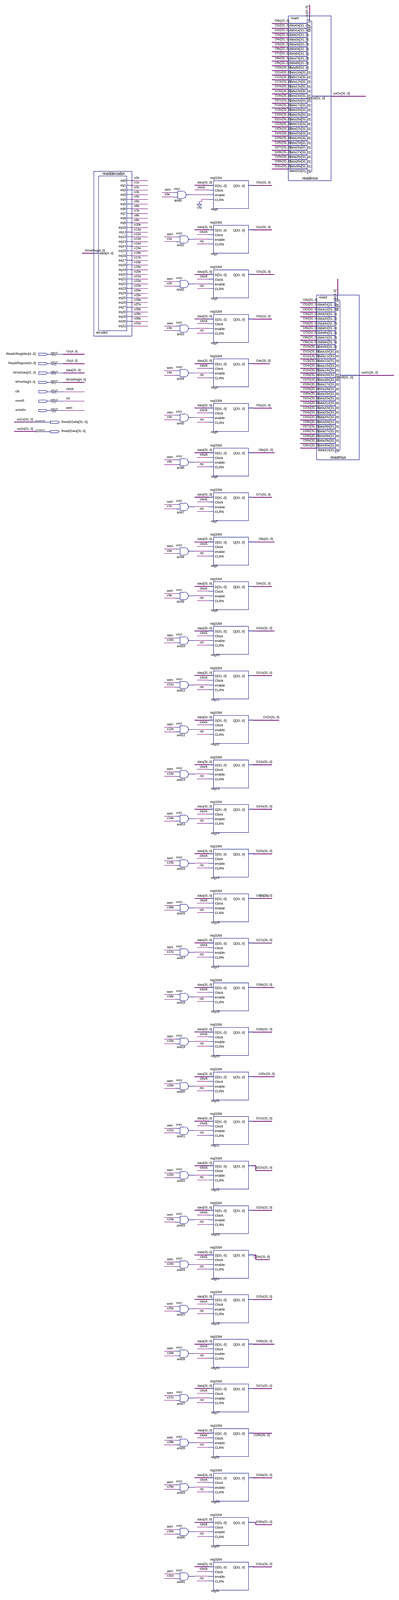
[diagram p0: schematic sheet, whole]
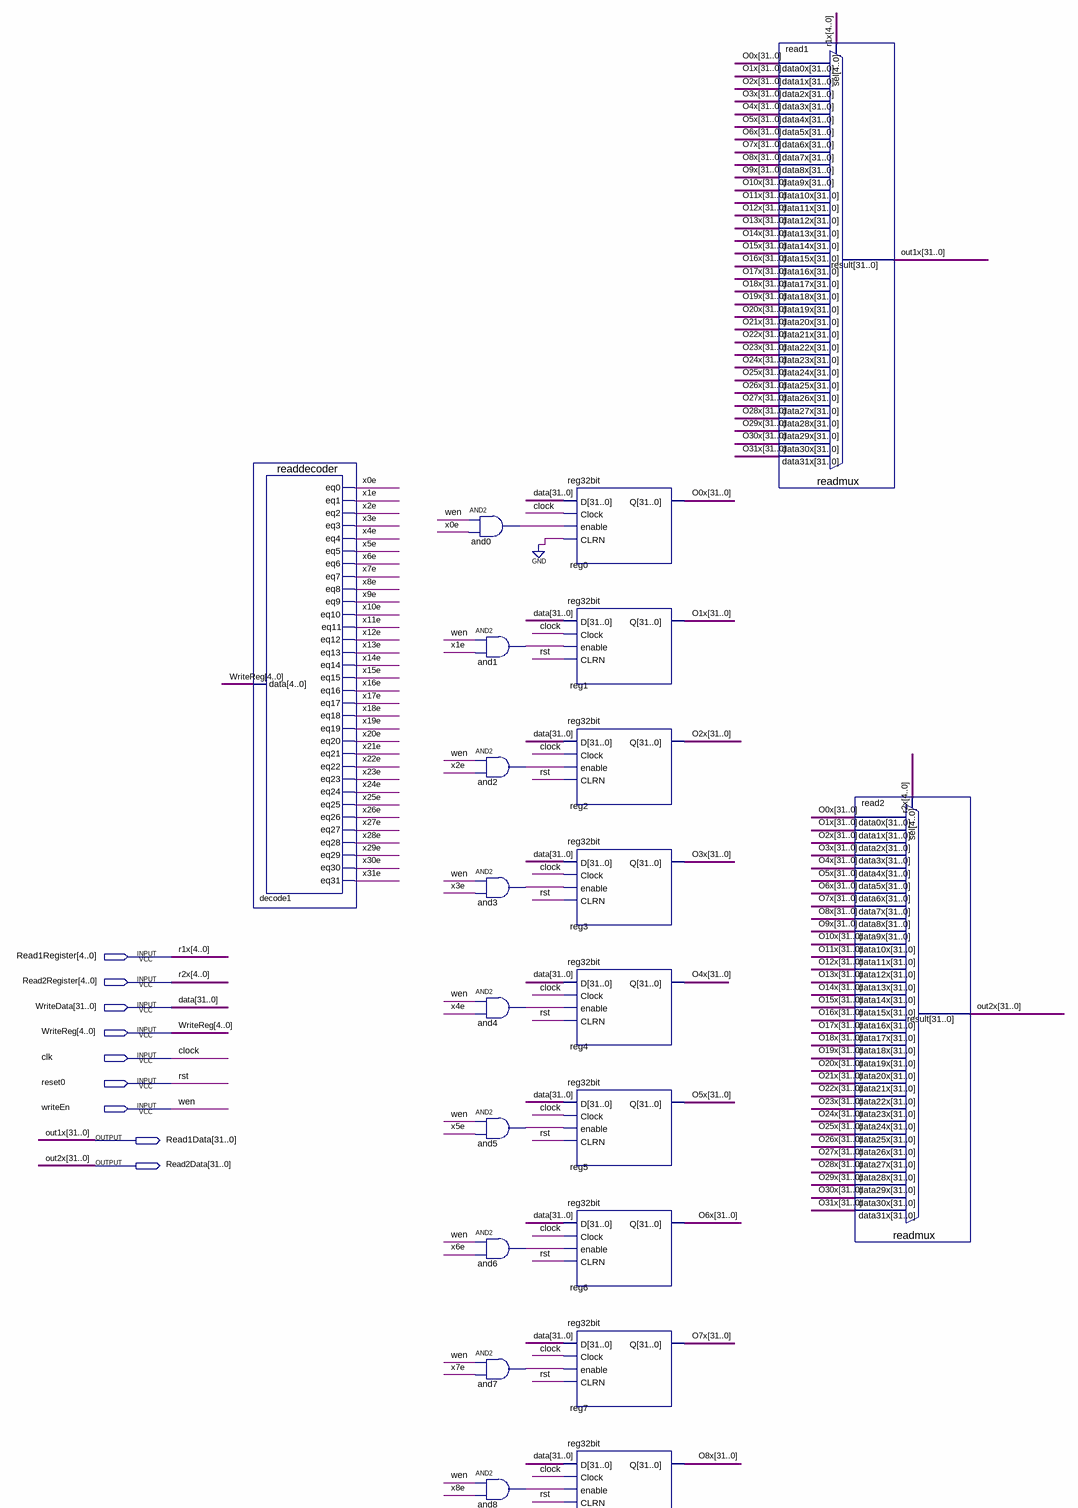
[diagram p1: schematic sheet, upper part]
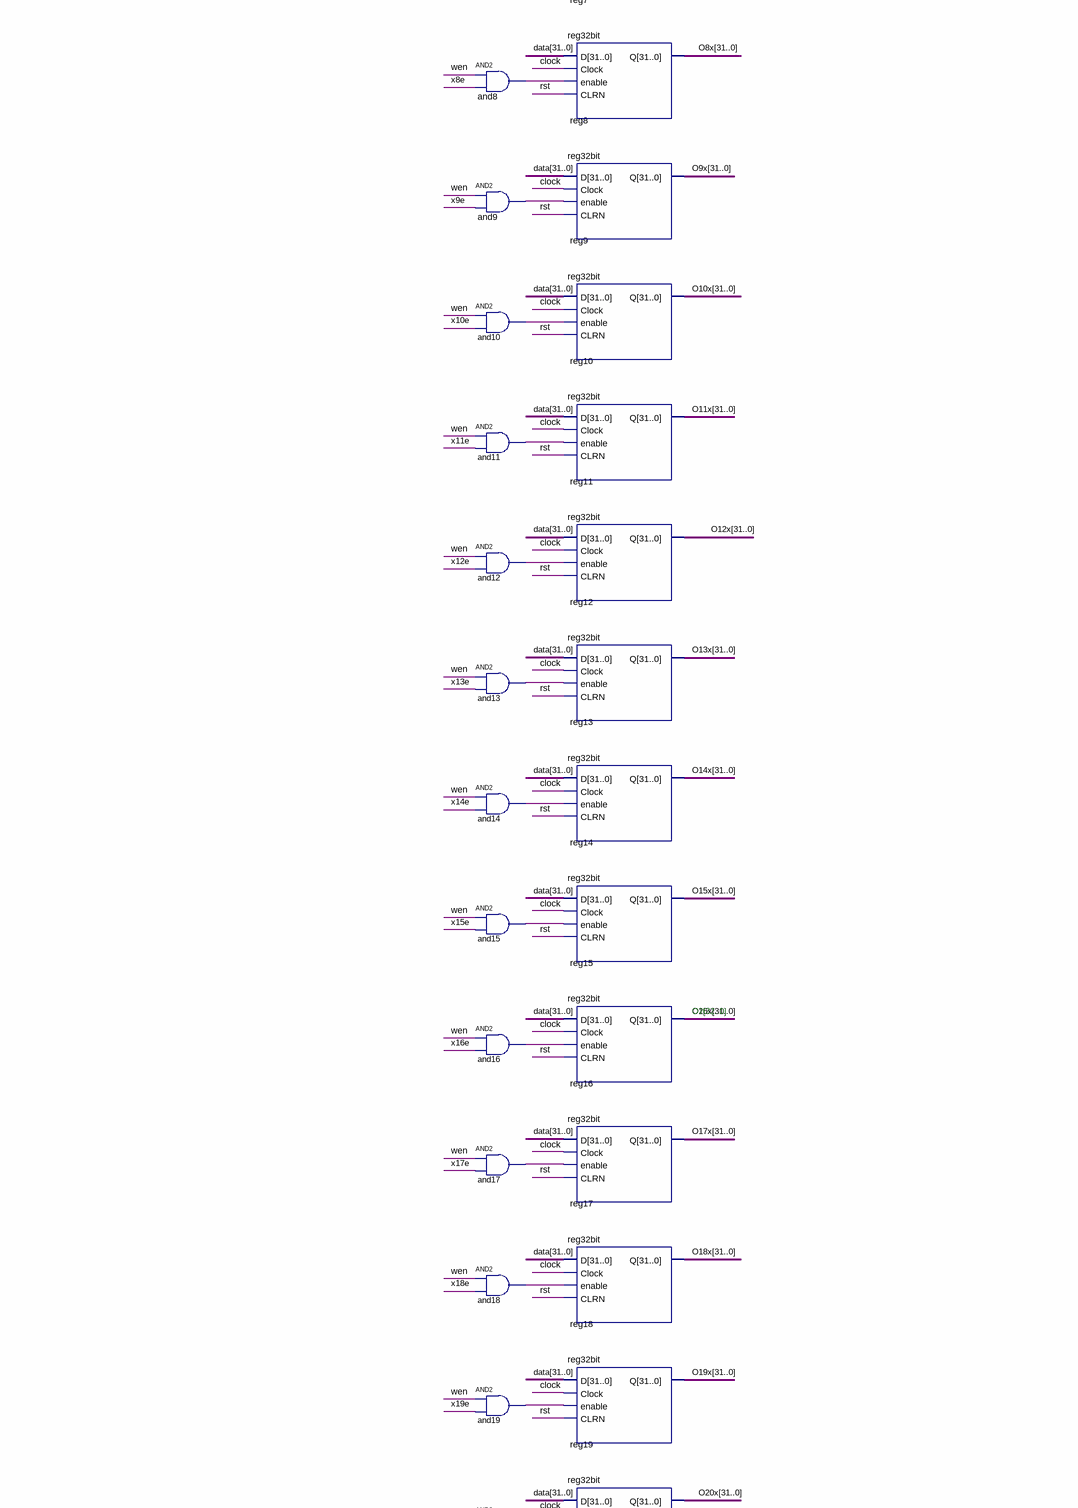
[diagram p2: schematic sheet, middle part]
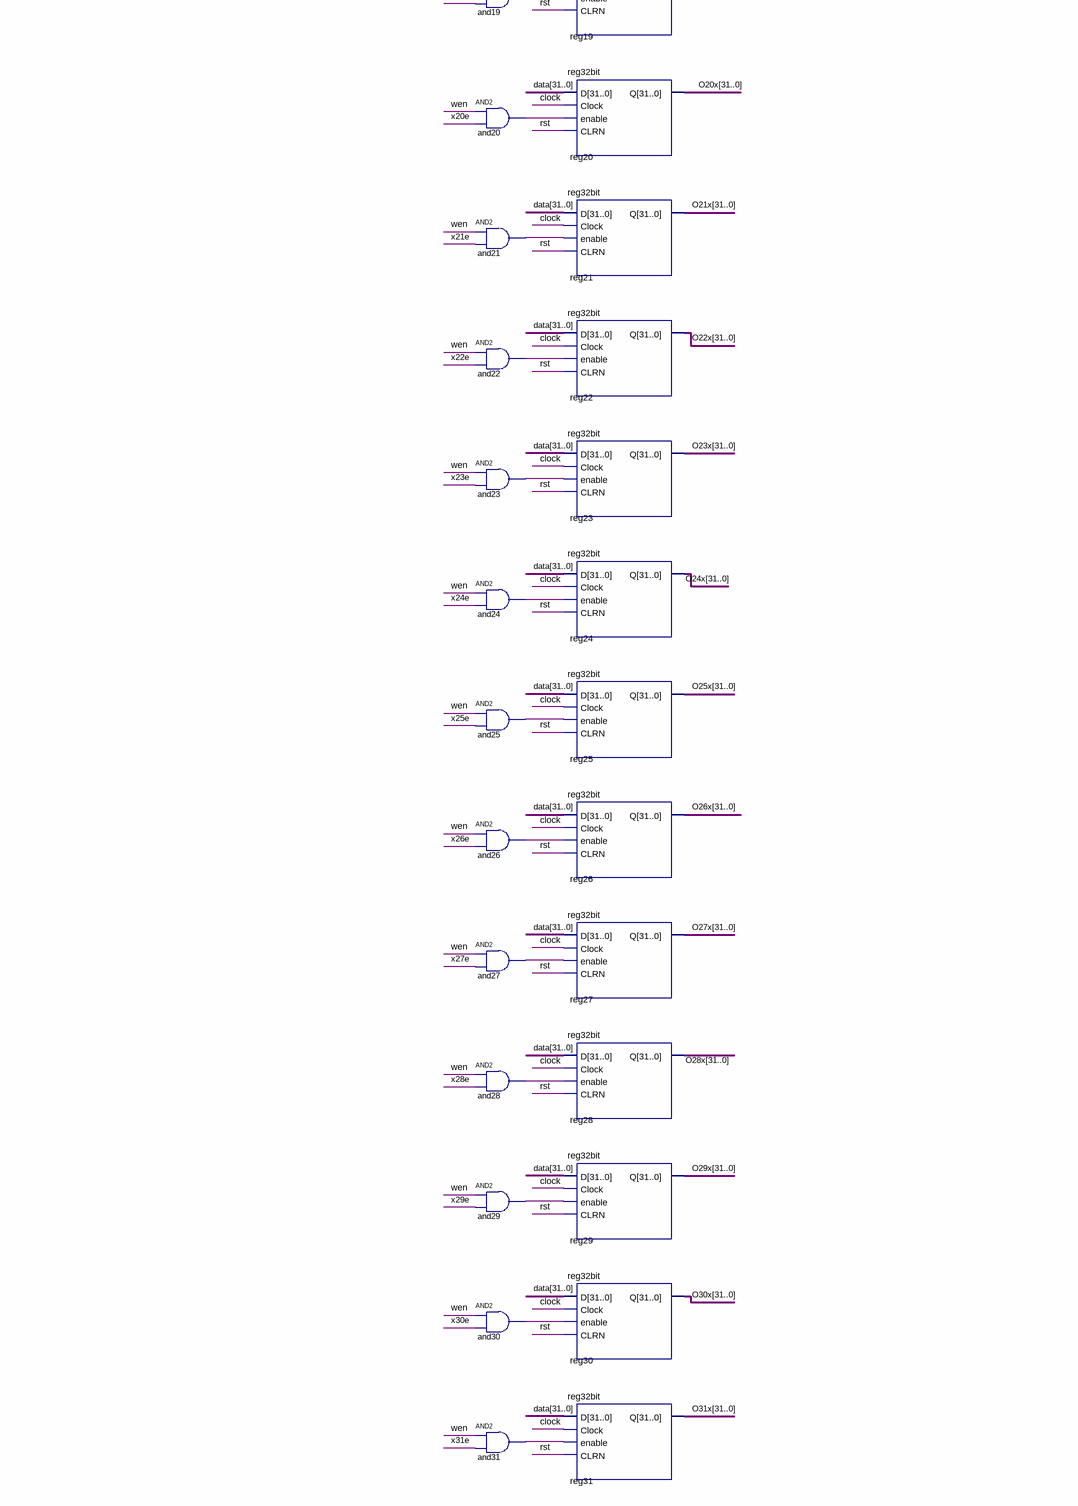
[diagram p3: schematic sheet, lower part]
// Quartus schematic regfile32.bdf as structural Verilog: 67 symbols, 9 pins
module regfile32 (
  input  [4:0] Read1Register,
  input  [4:0] Read2Register,
  input  [31:0] WriteData,
  input  [4:0] WriteReg,
  input  clk,
  input  reset0,
  input  writeEn,
  output [31:0] Read1Data,
  output [31:0] Read2Data
);

  wire and0_out, and1_out, and2_out, and3_out, and4_out, and5_out, and6_out, and7_out, and8_out, and9_out,
       and10_out, and11_out, and12_out, and13_out, and14_out, and15_out, and16_out, and17_out, and18_out,
       and19_out, and20_out, and21_out, and22_out, and23_out, and24_out, and25_out, and26_out, and27_out,
       and28_out, and29_out, and30_out, and31_out, x0e, x1e, x2e, x3e, x4e, x5e, x6e, x7e, x8e, x9e, x10e,
       x11e, x12e, x13e, x14e, x15e, x16e, x17e, x18e, x19e, x20e, x21e, x22e, x23e, x24e, x25e, x26e, x27e,
       x28e, x29e, x30e, x31e;
  wire [31:0] O0x, O1x, O2x, O3x, O4x, O5x, O6x, O7x, O8x, O9x, O10x, O11x, O12x, O13x, O14x, O15x, O16x,
       O17x, O18x, O19x, O20x, O21x, O22x, O23x, O24x, O25x, O26x, O27x, O28x, O29x, O30x, O31x;

  readdecoder decode1 (
    .data(WriteReg), .eq0(x0e), .eq1(x1e), .eq2(x2e), .eq3(x3e), .eq4(x4e), .eq5(x5e), .eq6(x6e), .eq7(x7e),
    .eq8(x8e), .eq9(x9e), .eq10(x10e), .eq11(x11e), .eq12(x12e), .eq13(x13e), .eq14(x14e), .eq15(x15e),
    .eq16(x16e), .eq17(x17e), .eq18(x18e), .eq19(x19e), .eq20(x20e), .eq21(x21e), .eq22(x22e), .eq23(x23e),
    .eq24(x24e), .eq25(x25e), .eq26(x26e), .eq27(x27e), .eq28(x28e), .eq29(x29e), .eq30(x30e), .eq31(x31e));
  and and0 (and0_out, writeEn, x0e);
  and and1 (and1_out, writeEn, x1e);
  and and2 (and2_out, writeEn, x2e);
  and and3 (and3_out, writeEn, x3e);
  and and4 (and4_out, writeEn, x4e);
  and and5 (and5_out, writeEn, x5e);
  and and6 (and6_out, writeEn, x6e);
  and and7 (and7_out, writeEn, x7e);
  and and8 (and8_out, writeEn, x8e);
  and and9 (and9_out, writeEn, x9e);
  and and10 (and10_out, writeEn, x10e);
  and and11 (and11_out, writeEn, x11e);
  and and12 (and12_out, writeEn, x12e);
  and and13 (and13_out, writeEn, x13e);
  and and14 (and14_out, writeEn, x14e);
  and and15 (and15_out, writeEn, x15e);
  and and16 (and16_out, writeEn, x16e);
  and and17 (and17_out, writeEn, x17e);
  and and18 (and18_out, writeEn, x18e);
  and and19 (and19_out, writeEn, x19e);
  and and20 (and20_out, writeEn, x20e);
  and and21 (and21_out, writeEn, x21e);
  and and22 (and22_out, writeEn, x22e);
  and and23 (and23_out, writeEn, x23e);
  and and24 (and24_out, writeEn, x24e);
  and and25 (and25_out, writeEn, x25e);
  and and26 (and26_out, writeEn, x26e);
  and and27 (and27_out, writeEn, x27e);
  and and28 (and28_out, writeEn, x28e);
  and and29 (and29_out, writeEn, x29e);
  and and30 (and30_out, writeEn, x30e);
  and and31 (and31_out, writeEn, x31e);
  reg32bit reg0 (.D(WriteData), .Clock(clk), .enable(and0_out), .CLRN(1'b0), .Q(O0x));
  reg32bit reg1 (.D(WriteData), .Clock(clk), .enable(and1_out), .CLRN(reset0), .Q(O1x));
  reg32bit reg2 (.D(WriteData), .Clock(clk), .enable(and2_out), .CLRN(reset0), .Q(O2x));
  reg32bit reg3 (.D(WriteData), .Clock(clk), .enable(and3_out), .CLRN(reset0), .Q(O3x));
  reg32bit reg4 (.D(WriteData), .Clock(clk), .enable(and4_out), .CLRN(reset0), .Q(O4x));
  reg32bit reg5 (.D(WriteData), .Clock(clk), .enable(and5_out), .CLRN(reset0), .Q(O5x));
  reg32bit reg6 (.D(WriteData), .Clock(clk), .enable(and6_out), .CLRN(reset0), .Q(O6x));
  reg32bit reg7 (.D(WriteData), .Clock(clk), .enable(and7_out), .CLRN(reset0), .Q(O7x));
  reg32bit reg8 (.D(WriteData), .Clock(clk), .enable(and8_out), .CLRN(reset0), .Q(O8x));
  reg32bit reg9 (.D(WriteData), .Clock(clk), .enable(and9_out), .CLRN(reset0), .Q(O9x));
  reg32bit reg10 (.D(WriteData), .Clock(clk), .enable(and10_out), .CLRN(reset0), .Q(O10x));
  reg32bit reg11 (.D(WriteData), .Clock(clk), .enable(and11_out), .CLRN(reset0), .Q(O11x));
  reg32bit reg12 (.D(WriteData), .Clock(clk), .enable(and12_out), .CLRN(reset0), .Q(O12x));
  reg32bit reg13 (.D(WriteData), .Clock(clk), .enable(and13_out), .CLRN(reset0), .Q(O13x));
  reg32bit reg14 (.D(WriteData), .Clock(clk), .enable(and14_out), .CLRN(reset0), .Q(O14x));
  reg32bit reg15 (.D(WriteData), .Clock(clk), .enable(and15_out), .CLRN(reset0), .Q(O15x));
  reg32bit reg16 (.D(WriteData), .Clock(clk), .enable(and16_out), .CLRN(reset0), .Q(O16x));
  reg32bit reg17 (.D(WriteData), .Clock(clk), .enable(and17_out), .CLRN(reset0), .Q(O17x));
  reg32bit reg18 (.D(WriteData), .Clock(clk), .enable(and18_out), .CLRN(reset0), .Q(O18x));
  reg32bit reg19 (.D(WriteData), .Clock(clk), .enable(and19_out), .CLRN(reset0), .Q(O19x));
  reg32bit reg20 (.D(WriteData), .Clock(clk), .enable(and20_out), .CLRN(reset0), .Q(O20x));
  reg32bit reg21 (.D(WriteData), .Clock(clk), .enable(and21_out), .CLRN(reset0), .Q(O21x));
  reg32bit reg22 (.D(WriteData), .Clock(clk), .enable(and22_out), .CLRN(reset0), .Q(O22x));
  reg32bit reg23 (.D(WriteData), .Clock(clk), .enable(and23_out), .CLRN(reset0), .Q(O23x));
  reg32bit reg24 (.D(WriteData), .Clock(clk), .enable(and24_out), .CLRN(reset0), .Q(O24x));
  reg32bit reg25 (.D(WriteData), .Clock(clk), .enable(and25_out), .CLRN(reset0), .Q(O25x));
  reg32bit reg26 (.D(WriteData), .Clock(clk), .enable(and26_out), .CLRN(reset0), .Q(O26x));
  reg32bit reg27 (.D(WriteData), .Clock(clk), .enable(and27_out), .CLRN(reset0), .Q(O27x));
  reg32bit reg28 (.D(WriteData), .Clock(clk), .enable(and28_out), .CLRN(reset0), .Q(O28x));
  reg32bit reg29 (.D(WriteData), .Clock(clk), .enable(and29_out), .CLRN(reset0), .Q(O29x));
  reg32bit reg30 (.D(WriteData), .Clock(clk), .enable(and30_out), .CLRN(reset0), .Q(O30x));
  reg32bit reg31 (.D(WriteData), .Clock(clk), .enable(and31_out), .CLRN(reset0), .Q(O31x));
  readmux read1 (
    .data31x(O31x), .data30x(O30x), .data29x(O29x), .data28x(O28x), .data27x(O27x), .data26x(O26x),
    .data25x(O25x), .data24x(O24x), .data23x(O23x), .data22x(O22x), .data21x(O21x), .data20x(O20x),
    .data19x(O19x), .data18x(O18x), .data17x(O17x), .data16x(O16x), .data15x(O15x), .data14x(O14x),
    .data13x(O13x), .data12x(O12x), .data11x(O11x), .data10x(O10x), .data9x(O9x), .data8x(O8x), .data7x(O7x),
    .data6x(O6x), .data5x(O5x), .data4x(O4x), .data3x(O3x), .data2x(O2x), .data1x(O1x), .data0x(O0x),
    .sel(Read1Register), .result(Read1Data));
  readmux read2 (
    .data31x(O31x), .data30x(O30x), .data29x(O29x), .data28x(O28x), .data27x(O27x), .data26x(O26x),
    .data25x(O25x), .data24x(O24x), .data23x(O23x), .data22x(O22x), .data21x(O21x), .data20x(O20x),
    .data19x(O19x), .data18x(O18x), .data17x(O17x), .data16x(O16x), .data15x(O15x), .data14x(O14x),
    .data13x(O13x), .data12x(O12x), .data11x(O11x), .data10x(O10x), .data9x(O9x), .data8x(O8x), .data7x(O7x),
    .data6x(O6x), .data5x(O5x), .data4x(O4x), .data3x(O3x), .data2x(O2x), .data1x(O1x), .data0x(O0x),
    .sel(Read2Register), .result(Read2Data));

  // Other names for the same wires on the sheet: clock = clk; data[31:0] = WriteData; out1x[31:0] = Read1Data;
  //   out2x[31:0] = Read2Data; r1x[4:0] = Read1Register; r2x[4:0] = Read2Register; rst = reset0; wen = writeEn

  // Notes on the sheet:
  //   O2[32..0]
endmodule
